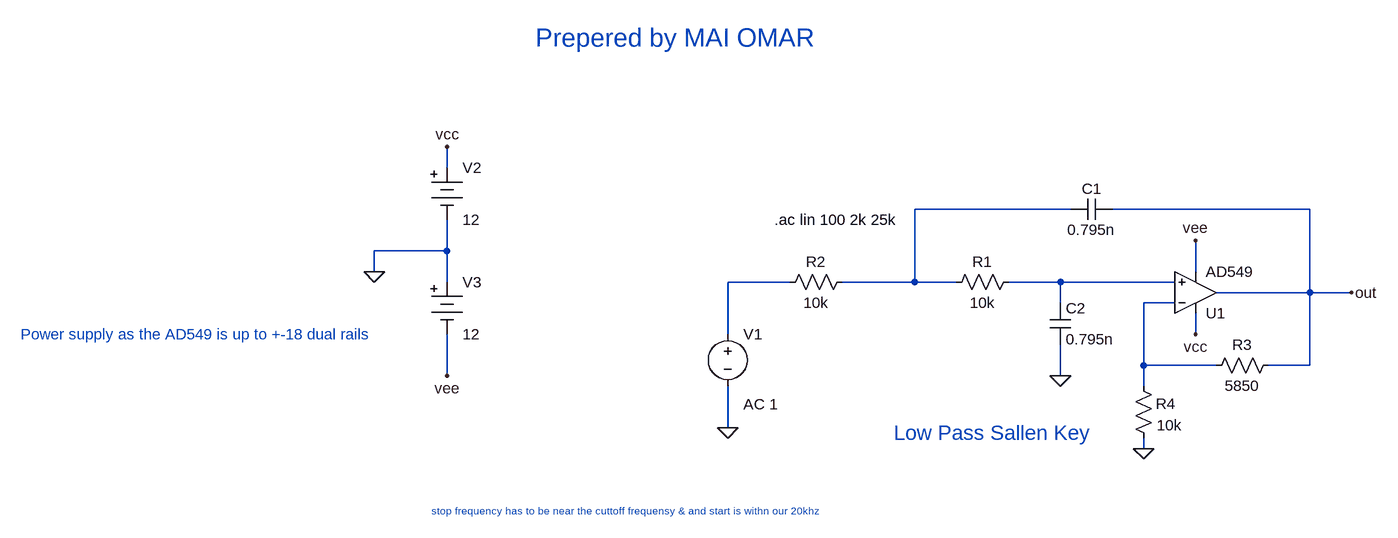
[diagram p0: schematic Sallen-Key.asc]
Sallen-Key.asc, the LTspice schematic file:
Version 4
SHEET 1 880 680
WIRE -672 -304 -672 -336
WIRE 288 -240 48 -240
WIRE 656 -240 352 -240
WIRE -672 -176 -672 -224
WIRE -672 -176 -784 -176
WIRE -784 -144 -784 -176
WIRE 480 -144 480 -192
WIRE -672 -128 -672 -176
WIRE -144 -128 -240 -128
WIRE 48 -128 48 -240
WIRE 48 -128 -64 -128
WIRE 112 -128 48 -128
WIRE 272 -128 192 -128
WIRE 448 -128 272 -128
WIRE 656 -112 656 -240
WIRE 656 -112 512 -112
WIRE 720 -112 656 -112
WIRE 272 -96 272 -128
WIRE 448 -96 400 -96
WIRE -240 -48 -240 -128
WIRE 480 -48 480 -80
WIRE 400 0 400 -96
WIRE 512 0 400 0
WIRE 656 0 656 -112
WIRE 656 0 592 0
WIRE -672 16 -672 -48
WIRE 272 16 272 -32
WIRE 400 32 400 0
WIRE -240 96 -240 32
WIRE 400 128 400 112
FLAG 400 128 0
FLAG 272 16 0
FLAG -240 96 0
FLAG 720 -112 out
FLAG -784 -144 0
FLAG -672 -336 vcc
FLAG -672 16 vee
FLAG 480 -48 vcc
FLAG 480 -192 vee
SYMBOL res 384 16 R0
WINDOW 0 35 43 Left 2
SYMATTR InstName R4
SYMATTR Value 10k
SYMBOL res 608 -16 R90
WINDOW 0 0 56 VBottom 2
WINDOW 3 32 56 VTop 2
SYMATTR InstName R3
SYMATTR Value 5850
SYMBOL OpAmps\\AD549 480 -48 M180
SYMATTR InstName U1
SYMBOL cap 352 -256 R90
WINDOW 0 0 32 VBottom 2
WINDOW 3 32 32 VTop 2
SYMATTR InstName C1
SYMATTR Value 0.795n
SYMBOL cap 256 -96 R0
SYMATTR InstName C2
SYMATTR Value 0.795n
SYMBOL res -48 -144 R90
WINDOW 0 0 56 VBottom 2
WINDOW 3 32 56 VTop 2
SYMATTR InstName R2
SYMATTR Value 10k
SYMBOL res 208 -144 R90
WINDOW 0 0 56 VBottom 2
WINDOW 3 32 56 VTop 2
SYMATTR InstName R1
SYMATTR Value 10k
SYMBOL voltage -240 -64 R0
WINDOW 123 24 124 Left 2
WINDOW 39 0 0 Left 0
SYMATTR Value2 AC 1
SYMATTR InstName V1
SYMATTR Value ""
SYMBOL Misc\\battery -672 -320 R0
WINDOW 123 0 0 Left 0
WINDOW 39 0 0 Left 0
SYMATTR InstName V2
SYMATTR Value 12
SYMBOL Misc\\battery -672 -144 R0
WINDOW 123 0 0 Left 0
WINDOW 39 0 0 Left 0
SYMATTR InstName V3
SYMATTR Value 12
TEXT 16 104 Left 3 ;Low Pass Sallen Key
TEXT -1328 -48 Left 2 ;Power supply as the AD549 is up to +-18 dual rails
TEXT -168 -224 Left 2 !.ac lin 100 2k 25k
TEXT -696 224 Left 1 ;stop frequency has to be near the cuttoff frequensy & and start is withn our 20khz
TEXT -536 -504 Left 4 ;Prepered by MAI OMAR

The netlist it stands for:
* Sallen-Key.asc
R4 N004 0 10k
R3 out N004 5850
XU1 N003 N004 vcc vee out AD549  ; pins In+ In- V+ V- OUT
C1 out N001 0.795n
C2 N003 0 0.795n
R2 N001 N002 10k
R1 N003 N001 10k
V1 N002 0 AC 1
V2 vcc 0 12
V3 0 vee 12
* Low Pass Sallen Key
* Power supply as the AD549 is up to +-18 dual rails
.ac lin 100 2k 25k
* stop frequency has to be near the cuttoff frequensy & and start is withn our 20khz
* Prepered by MAI OMAR
.backanno
.end